# Altium schematic sheet xbowtie1.SchDoc
size A3; SheetNumber: 1; SheetTotal: 3
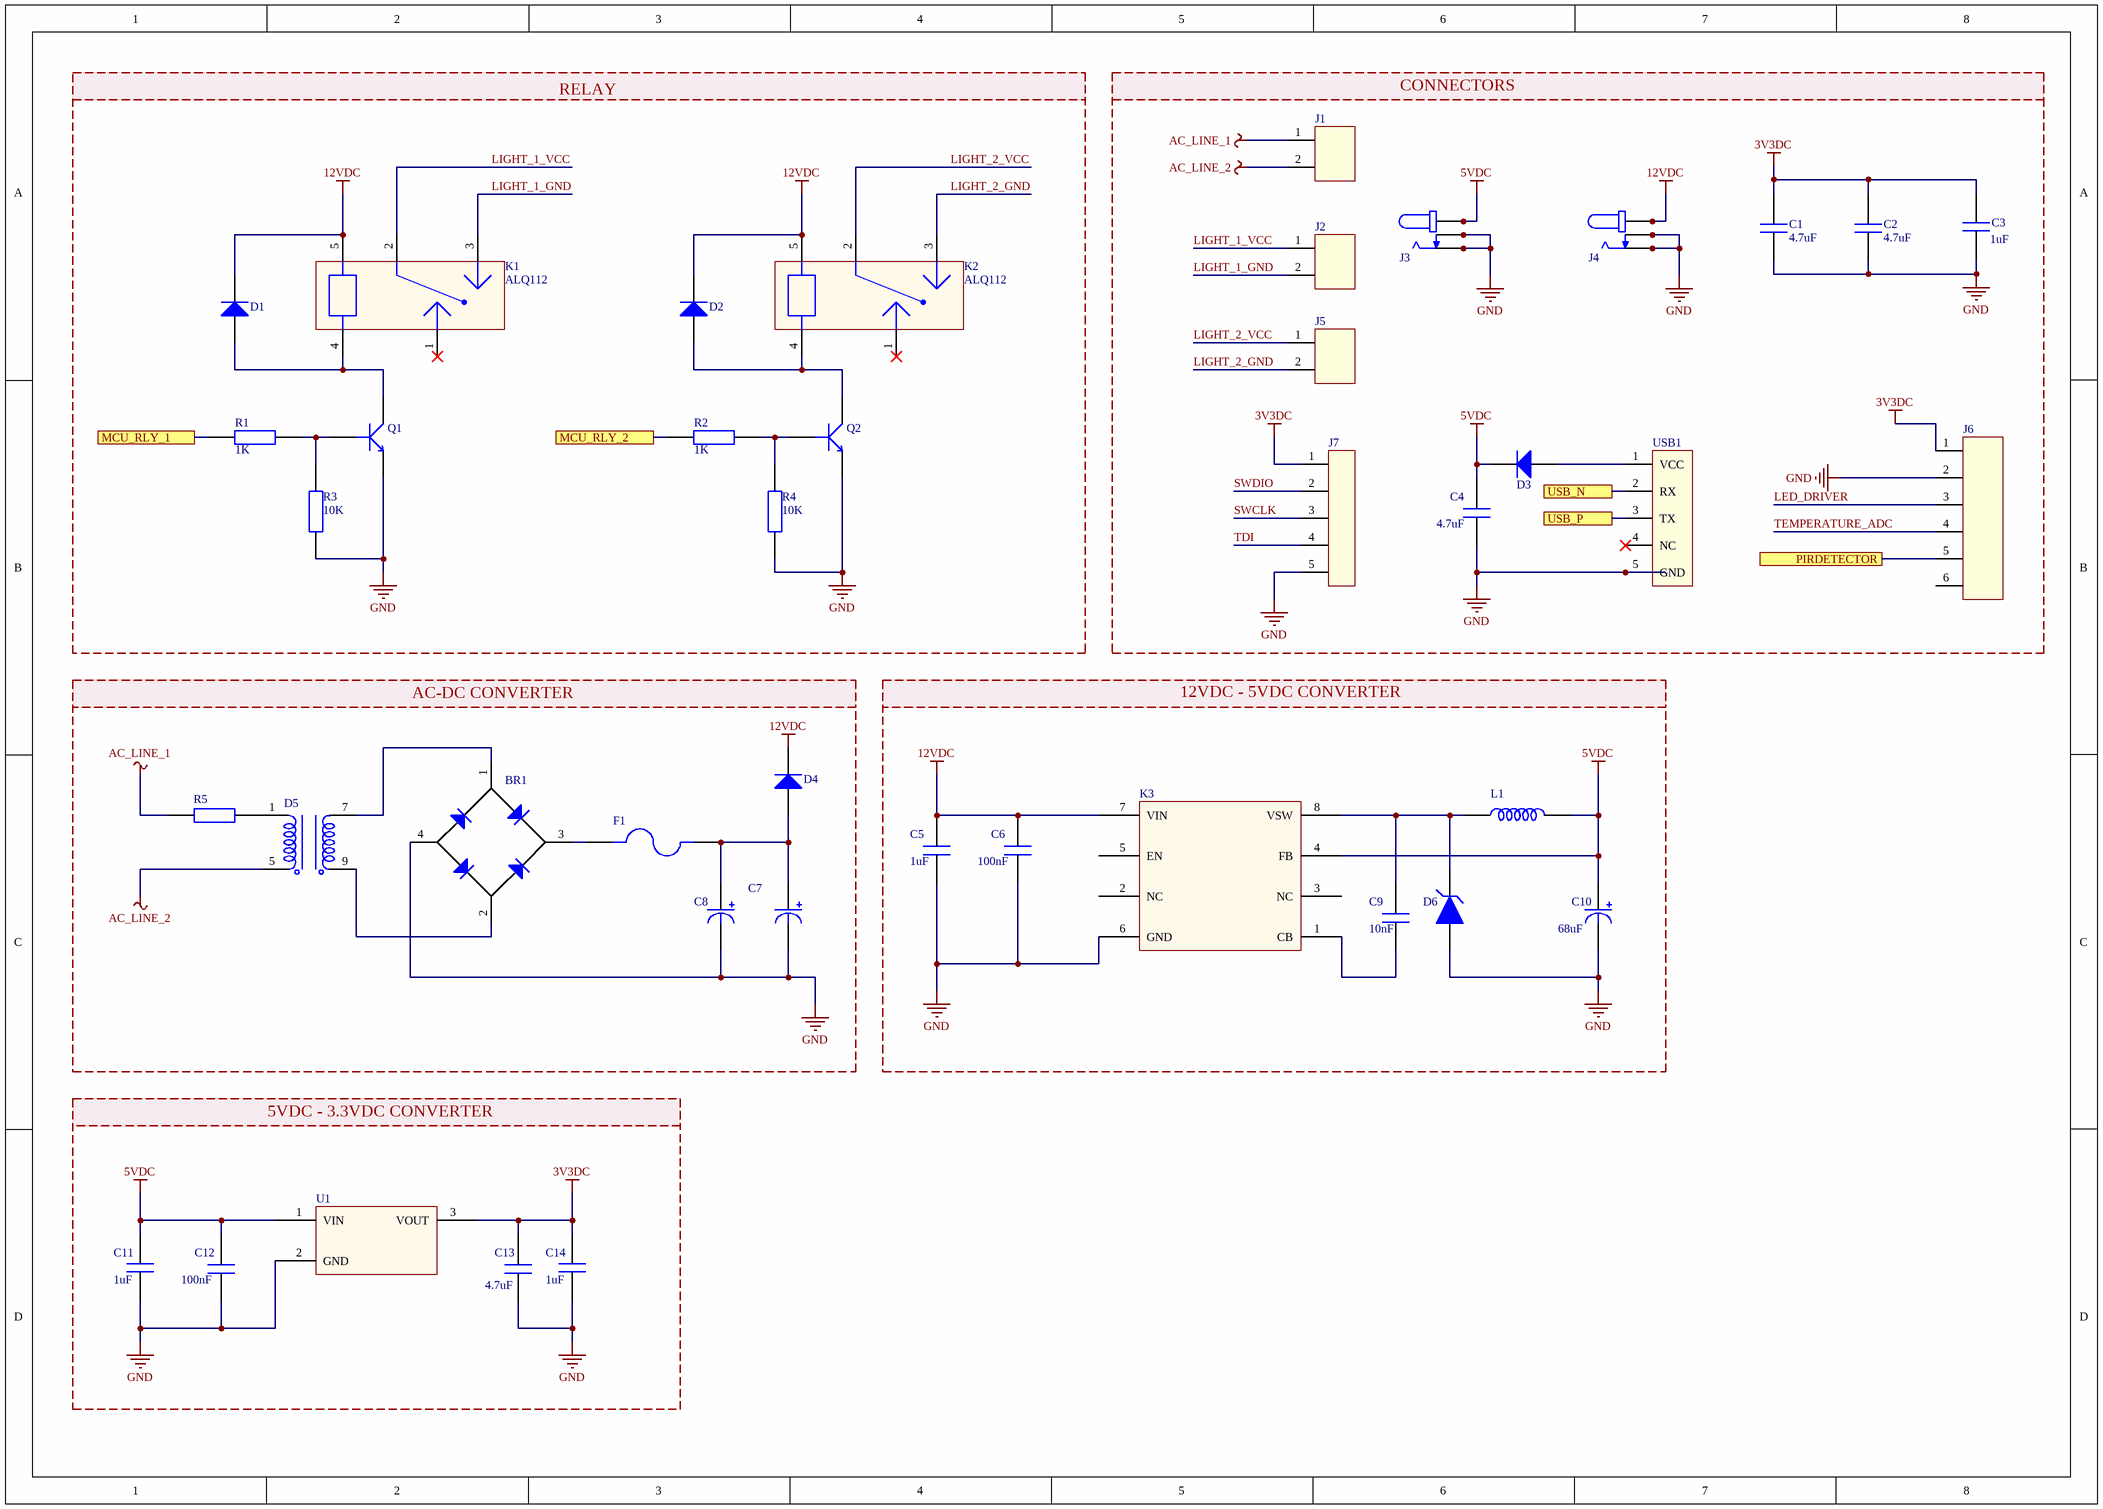
[diagram p0: xbowtie1.SchDoc]

## Parts
BR1  DB105STR  [DB105STR]  (value not drawn)
C1  4.7uF  [CAP_CER 0805]
C2  4.7uF  [CAP_CER 0805]
C3  Capacitance: 1uF  [CAP_CER 0805]  (hidden comment: CAP CER 1uF 0805)
C4  4.7uF  [CAP_CER 0805]
C5  1uF  [CAP_CER 0805]
C6  100nF  [CAP_CER 0805]
C7  ESH477M050AH4AA  [ESH477]  (value not drawn)
C8  ESH477M050AH4AA  [ESH477]  (value not drawn)
C9  10nF  [cap_0603]
C10  68uF  [CAP ALU 68 uF]
C11  Capacitance: 1uF  [CAP_CER 0805]  (hidden comment: CAP CER 1uF 0805)
C12  100nF  [CAP_CER 0805]
C13  Capacitance: 4.7uF  [CAP_CER 0805]  (hidden comment: CAP CER 4.7uF 0805)
C14  Capacitance: 1uF  [CAP_CER 0805]  (hidden comment: CAP CER 1uF 0805)
D1  1N4148WS  [1N4148WS]  (value not drawn)
D2  1N4148WS  [1N4148WS]  (value not drawn)
D3  1N4148WS  [1N4148WS]  (value not drawn)
D4  1N4148WS  [1N4148WS]  (value not drawn)
D5  BV302S12010_ZU  [BV302S]  (value not drawn)
D6  1SMB5919BT3G  [1SMB5919BT3G]  (value not drawn)
F1  FUSE 3413.0216.22  [FUSE 3413.0216.22]  (value not drawn)
J1  TBP01R1-508-02BE  [TBP01R1-508]  (value not drawn)
J2  TBP01R1-508-02BE  [TBP01R1-508]  (value not drawn)
J3  PJ-037AH-SMT-TR  [JACK]  (value not drawn)
J4  PJ-037AH-SMT-TR  [JACK]  (value not drawn)
J5  TBP01R1-508-02BE  [TBP01R1-508]  (value not drawn)
J6  64800611622  [64800611622]  (value not drawn)
J7  SMH-105-02-LS  [5 PIN CONNECTOR]  (value not drawn)
K1  ALQ112  [ALQ112]
K2  ALQ112  [ALQ112]
K3  LM2675MX-12/NOPB  [LM2675MX-12/NOPB]  (value not drawn)
L1  78438335470  [IND_1212]  (value not drawn)
Q1  MMBT3904-7-F  [MMBT3904-7-F]  (value not drawn)
Q2  MMBT3904-7-F  [MMBT3904-7-F]  (value not drawn)
R1  1K  [RES_0603]
R2  1K  [RES_0603]
R3  10K  [RES_0603]
R4  10K  [RES_0603]
R5  5WD27  [5WD27]  (value not drawn)
U1  AP7361-33E-13  [AP7361-33E-13]  (value not drawn)
USB1  10118192-0001LF  [MICRO_B_USB]  (value not drawn)

## Blocks framed on the sheet
RELAY: D1 D2 K1 K2 Q1 Q2 R1-R4

## Ports
MCU_RLY_1, MCU_RLY_2, PIRDETECTOR, USB_N, USB_P

## Nets
3V3DC: C1.2 C2.2 C3.2 C13.2 C14.2 J6.1(VCC) J7.1 U1.3(VOUT)
5VDC: C4.2 C10.1 C11.2 C12.2 D3.1 J3.1A J3.1B K3.4(FB) L1.2 U1.1(VIN)
12VDC: C5.2 C6.2 D1.1 D2.1 D4.1 J4.1A J4.1B K1.5 K2.5 K3.7(VIN)
AC_LINE_1: J1.1 R5.1
AC_LINE_2: D5.5 J1.2
GND: BR1.4 C1.1 C2.1 C3.1 C4.1 C5.1 C6.1 C7.2 C8.2 C10.2 C11.1 C12.1 C13.1 C14.1 D6.1 J3.2A J3.2B J3.3A J3.3B J4.2A J4.2B J4.3A J4.3B J6.2(RX) J7.5 K3.6(GND) Q1.2(E) Q2.2(E) R3.1 R4.1 U1.2(GND) USB1.5(GND)
LED_DRIVER: J6.3(TX)
LIGHT_1_GND: J2.2 K1.3
LIGHT_1_VCC: J2.1 K1.2
LIGHT_2_GND: J5.2 K2.3
LIGHT_2_VCC: J5.1 K2.2
MCU_RLY_1: R1.1 ; port MCU_RLY_1
MCU_RLY_2: R2.1 ; port MCU_RLY_2
PIRDETECTOR: J6.5(GND) ; port PIRDETECTOR
SWCLK: J7.3
SWDIO: J7.2
TDI: J7.4
TEMPERATURE_ADC: J6.4(NC)
USB_N: USB1.2(RX) ; port USB_N
USB_P: USB1.3(TX) ; port USB_P
NetBR1_1: BR1.1 D5.7
NetBR1_2: BR1.2 D5.9
NetBR1_3: BR1.3 F1.1
NetC7_1: C7.1 C8.1 D4.2 F1.2
NetC9_1: C9.1 K3.1(CB)
NetC9_2: C9.2 D6.2 K3.8(VSW) L1.1
NetD1_2: D1.2 K1.4 Q1.C
NetD2_2: D2.2 K2.4 Q2.C
NetD3_2: D3.2 USB1.1(VCC)
NetD5_1: D5.1 R5.2
NetQ1_1: Q1.1(B) R1.2 R3.2
NetQ2_1: Q2.1(B) R2.2 R4.2

Not connected (* = marked no-connect by the designer): J6 6(GND); K1 1(2)*; K2 1(2)*; K3 2(NC) 3(NC) 5(EN); USB1 4(NC)*

## Notes on the sheet
- CONNECTORS
- AC-DC CONVERTER
- 12VDC - 5VDC CONVERTER
- 5VDC - 3.3VDC CONVERTER

## Library data of the parts
C1 C2 C4 C13 = CAP CER 4.7uF 0805: Manufacturer: Samsung; Manufacturer Part Number: CL21A475KBQNNNE; Material: 4241ConductorMaterial; Tolerance: 10%; Voltage Rating: 50V; Dielectric: X5R; Supplier 1: Digikey; RoHS: Yes; Category: Ceramic Capacitors; Stock 1: 277343; Pricing 1: 1=0,23, 10=0,148, 50=0,104, 100=0,084, 500=0,06244, 1000=0,05464 (USD); Mount: Surface Mount; Case/Package: 0805; Case Code (Metric): 2012; Case Code (Imperial): 0805; Min Operating Temperature: -55°C; Max Operating Temperature: 85°C; Packaging: Tape and Reel; Series: CL; Voltage Rating (DC): 50V; Package Quantity: 1; Length: 2mm; Width: 0.049inch; Thickness: 0.055inch; Depth: 1.25mm; Radiation Hardening: No; RoHS Compliant: Yes; ComponentLink1URL: https://datasheet.ciiva.com/25797/cl21a475kbqnnne-25797730.pdf?src-supplier=Digikey; ComponentLink1Description: https://datasheet.ciiva.com/25797/cl21a475kbqnnne-25797730.pdf?src-supplier=Digikey; ComponentLink2URL: https://datasheet.ciiva.com/16428/cl21a475kbqnnne-16428877.pdf?src-supplier=Future+Electronics; ComponentLink2Description: https://datasheet.ciiva.com/16428/cl21a475kbqnnne-16428877.pdf?src-supplier=Future+Electronics; ComponentLink3URL: https://datasheet.ciiva.com/26838/getdatasheetpartid-470982-26838620.pdf?src-supplier=Verical; ComponentLink3Description: https://datasheet.ciiva.com/26838/getdatasheetpartid-470982-26838620.pdf?src-supplier=Verical; Supplier Part Number 1: 1276-1248-1-ND
  C1 C2 C4: Capacitance: 4.7uF
C3 C5 C11 C14 = CAP CER 1uF 0805: CAP CER 1uF %10 0805; Manufacturer: Samsung; Manufacturer Part Number: CL21B105KBFNNNE; Material: Ceramic; Tolerance: 10%; Voltage Rating: 50V; Dielectric: X7R; Supplier 1: Digikey; RoHS: Yes; Category: Ceramic Capacitors; Stock 1: 1550845; Pricing 1: 1=0,11, 10=0,075, 50=0,045, 100=0,0354, 500=0,02616, 1000=0,02165 (USD); Mount: Surface Mount; Case/Package: 0805; Case Code (Metric): 2012; Case Code (Imperial): 0805; Min Operating Temperature: -55°C; Max Operating Temperature: 125°C; Packaging: Tape and Reel; Package Quantity: 1; Voltage: 50V; Series: CL; Construction: Flat; Voltage Rating (DC): 50V; Length: 2mm; Width: 0.049inch; Height: 1.25mm; Thickness: 0.053inch; Depth: 1.25mm; Radiation Hardening: No; RoHS Compliant: Yes; ComponentLink1URL: https://datasheet.ciiva.com/25800/cl21b105kbfnnne-25800291.pdf?src-supplier=Digikey; ComponentLink1Description: https://datasheet.ciiva.com/25800/cl21b105kbfnnne-25800291.pdf?src-supplier=Digikey; Supplier Part Number 1: 1276-1029-1-ND
  C5: Capacitance: 1uF
C6 C12 = CAP CER 100nF 0805
C7 C8 = ESH477M050AH4AA: Cap, 470UF, 50V, Alu Elec, Radial; Manufacturer: KEMET; Supplier 1: Digikey; Manufacturer Part Number: ESH477M050AH4AA; RoHS: Yes; Stock 1: 10867; Pricing 1: 1=0,64, 10=0,432, 200=0,28415, 1000=0,1887, 5000=0,1665, 10000=0,1554 (USD); ComponentLink1URL: https://api.kemet.com/component-edge/download/datasheet/ESH477M050AH4AA.pdf?src-supplier=Digikey; ComponentLink1Description: https://api.kemet.com/component-edge/download/datasheet/ESH477M050AH4AA.pdf?src-supplier=Digikey; ComponentLink2URL: https://datasheet.octopart.com/ESH477M050AH4AA-KEMET-datasheet-130075338.pdf?src-supplier=Newark; ComponentLink2Description: https://datasheet.octopart.com/ESH477M050AH4AA-KEMET-datasheet-130075338.pdf?src-supplier=Newark; Supplier Part Number 1: 399-15683-ND
C9 = CAP CER 10nF 0603: Manufacturer: Walsin Technologies; Manufacturer Part Number: 0603B103K160CT; Supplier 1: Digikey; RoHS: Yes; Category: Ceramic Capacitors; Stock 1: 97748; Pricing 1: 1=0,1, 10=0,032, 50=0,0182, 100=0,0141, 500=0,0106, 1000=0,00833 (USD); Lead Free: 5697LeadFree; ComponentLink1URL: http://www.farnell.com/datasheets/1958513.pdf?src-supplier=Farnell; ComponentLink1Description: http://www.farnell.com/datasheets/1958513.pdf?src-supplier=Farnell; ComponentLink2URL: https://datasheet.octopart.com/0603B103K160CT-Walsin-Technologies-datasheet-136037192.pdf?src-supplier=Future+Electronics; ComponentLink2Description: https://datasheet.octopart.com/0603B103K160CT-Walsin-Technologies-datasheet-136037192.pdf?src-supplier=Future+Electronics; ComponentLink3URL: http://www.passivecomponent.com/wp-content/uploads/2018/10/MLCC.pdf?src-supplier=Digikey; ComponentLink3Description: http://www.passivecomponent.com/wp-content/uploads/2018/10/MLCC.pdf?src-supplier=Digikey; ComponentLink4URL: https://datasheet.octopart.com/0603B103K160CT-Walsin-Technologies-datasheet-85392065.pdf?src-supplier=Element14; ComponentLink4Description: https://datasheet.octopart.com/0603B103K160CT-Walsin-Technologies-datasheet-85392065.pdf?src-supplier=Element14; ComponentLink5URL: https://datasheet.octopart.com/0603B103K160CT-Walsin-Technologies-datasheet-62066062.pdf?src-supplier=TME; ComponentLink5Description: https://datasheet.octopart.com/0603B103K160CT-Walsin-Technologies-datasheet-62066062.pdf?src-supplier=TME; Supplier Part Number 1: 1292-1384-1-ND
C10 = CAP ALU 68 uF: Cap Aluminum Lytic 68uF 35V 20%( 6.3 X 7.7mm) SMD 0.34 Ohm 280mA 2000h 105C T/R; Manufacturer: KEMET; Manufacturer Part Number: EEV686M035A9HAA; Supplier 1: Digikey; RoHS: Yes; Category: Aluminum Electrolytic Capacitors; Stock 1: 22813; Pricing 1: 1=0,59, 10=0,394, 50=0,3134, 100=0,2588, 500=0,2022 (USD); ComponentLink1URL: https://datasheet.ciiva.com/5365/kem-a4002-eev-535332-5365784.pdf?src-supplier=Mouser; ComponentLink1Description: https://datasheet.ciiva.com/5365/kem-a4002-eev-535332-5365784.pdf?src-supplier=Mouser; Supplier Part Number 1: 399-6722-1-ND
D1-D4 = 1N4148WS: Diode Ultra Fast Recovery Rectifier 75V 0.15A 2-Pin SOD-323F T/R; Manufacturer: ON Semiconductor / Fairchild; Max Reverse Current: 5uA; Average Rectified Current: 150mA; Reverse Recovery Time: 4ns; Max Forward Surge Current (Ifsm): 2A; Capacitance: 4pF; Element Configuration: Single; Supplier 1: Digikey; Manufacturer Part Number: 1N4148WS; RoHS: Yes; Category: Rectifier Diodes; Stock 1: 807861; Pricing 1: 1=0,19, 10=0,136, 100=0,0733, 500=0,0576, 1000=0,04 (USD); Mount: Surface Mount; Number of Pins: 2; Weight: 0.0276g; Min Operating Temperature: -55°C; Max Operating Temperature: 150°C; Max Reverse Voltage (DC): 75V; Series: -; Packaging: Tape and Reel; Forward Current: 150mA; Package Quantity: 1; Recovery Time: 4ns; Max Repetitive Reverse Voltage (Vrrm): 75V; Reverse Voltage: 75V; Length: 1.8mm; Width: 1.35mm; Height: 1mm; Radiation Hardening: No; RoHS Compliant: Yes; Reach SVHC Compliant: No; Lead Free: Lead Free; ComponentLink1URL: https://datasheet.ciiva.com/15208/getdatasheetpartid-127819-15208358.pdf?src-supplier=Verical; ComponentLink1Description: https://datasheet.ciiva.com/15208/getdatasheetpartid-127819-15208358.pdf?src-supplier=Verical; ComponentLink2URL: https://datasheet.ciiva.com/8300/1n914bws-8300360.pdf?src-supplier=Avnet; ComponentLink2Description: https://datasheet.ciiva.com/8300/1n914bws-8300360.pdf?src-supplier=Avnet; ComponentLink3URL: https://datasheet.ciiva.com/910/1n4148ws-910381.pdf?src-supplier=Digikey; ComponentLink3Description: https://datasheet.ciiva.com/910/1n4148ws-910381.pdf?src-supplier=Digikey; Supplier Part Number 1: 1N4148WSFSCT-ND
D6 = 1SMB5919BT3G: Vz=5.6V 5.32V~5.88V Izt=66.9mA; Manufacturer: ON Semiconductor; Supplier 1: Digikey; Manufacturer Part Number: 1SMB5919BT3G; RoHS: Yes; Category: Zener Diodes; Stock 1: 209; Pricing 1: 1=0,48, 10=0,341, 100=0,1722, 500=0,15262, 1000=0,11878 (USD); ComponentLink1URL: https://datasheet.ciiva.com/27747/1308331-27747654.pdf?src-supplier=Jameco; ComponentLink1Description: https://datasheet.ciiva.com/27747/1308331-27747654.pdf?src-supplier=Jameco; ComponentLink2URL: https://datasheet.ciiva.com/1182/1smb5913bt3-d-1182657.pdf?src-supplier=Element14; ComponentLink2Description: https://datasheet.ciiva.com/1182/1smb5913bt3-d-1182657.pdf?src-supplier=Element14; ComponentLink3URL: https://datasheet.ciiva.com/1182/1smb5913bt3-d-1182658.pdf?src-supplier=Element14; ComponentLink3Description: https://datasheet.ciiva.com/1182/1smb5913bt3-d-1182658.pdf?src-supplier=Element14; ComponentLink4URL: https://datasheet.ciiva.com/895/1smb5913bt3-d-895203.pdf?src-supplier=Digikey; ComponentLink4Description: https://datasheet.ciiva.com/895/1smb5913bt3-d-895203.pdf?src-supplier=Digikey; ComponentLink5URL: https://datasheet.ciiva.com/895/1smb5913bt3-d-895204.pdf?src-supplier=Digikey; ComponentLink5Description: https://datasheet.ciiva.com/895/1smb5913bt3-d-895204.pdf?src-supplier=Digikey; ComponentLink6URL: https://datasheet.ciiva.com/895/1smb5913bt3-d-895205.pdf?src-supplier=Digikey; ComponentLink6Description: https://datasheet.ciiva.com/895/1smb5913bt3-d-895205.pdf?src-supplier=Digikey; ComponentLink7URL: https://datasheet.ciiva.com/15198/getdatasheetpartid-311040-15198695.pdf?src-supplier=Verical; ComponentLink7Description: https://datasheet.ciiva.com/15198/getdatasheetpartid-311040-15198695.pdf?src-supplier=Verical; ComponentLink8URL: https://datasheet.ciiva.com/16311/1smb5913bt3-d-16311847.pdf?src-supplier=Future+Electronics; ComponentLink8Description: https://datasheet.ciiva.com/16311/1smb5913bt3-d-16311847.pdf?src-supplier=Future+Electronics; Supplier Part Number 1: 1SMB5919BT3GOSCT-ND
F1 = FUSE 3413.0216.22: Fuse Chip Fast Acting 1A 32V SMD Solder Pad 1206 Glass T/R VDE/cULus; Manufacturer: Schurter; Body Material: Glass,Epoxy; Voltage Rating (DC): 63V; DC Cold Resistance: 94.2mR; Fuse Type: Board Mount (Cartridge Style Excluded); Approvals: VDE,cURus; Designed by: Nisanur; Supplier 1: Digikey; Manufacturer Part Number: 3413.0216.22; RoHS: Yes; Category: Fuses; Stock 1: 15097; Pricing 1: 1=0,67, 50=0,524, 100=0,397, 500=0,345 (USD); Mount: Surface Mount,PCB; Case/Package: 1206; Number of Pins: 2; Weight: 0.000212oz; Case Code (Metric): 3216; Case Code (Imperial): 1206; Contact Plating: Gold; Terminal Material: Tin; Min Operating Temperature: -55°C; Max Operating Temperature: 90°C; Current Rating: 1A; Package Quantity: 1000; Voltage Rating (AC): 32V; Packaging: Tape and Reel; Voltage Rating: 32V; Termination: SMD/SMT; Working Voltage: 32V; Series: USI 1206; Length: 3.2mm; Width: 1.6mm; Height: 0.6mm; Lead Free: Lead Free; RoHS Compliant: Yes; ComponentLink1URL: https://datasheet.ciiva.com/301/typ-usi-1206-301440.pdf?src-supplier=Digikey; ComponentLink1Description: https://datasheet.ciiva.com/301/typ-usi-1206-301440.pdf?src-supplier=Digikey; ComponentLink2URL: https://datasheet.ciiva.com/8264/typ-usi-1206-8264583.pdf?src-supplier=Avnet; ComponentLink2Description: https://datasheet.ciiva.com/8264/typ-usi-1206-8264583.pdf?src-supplier=Avnet; ComponentLink3URL: https://datasheet.ciiva.com/16316/typ-usi-1206-16316588.pdf?src-supplier=Future+Electronics; ComponentLink3Description: https://datasheet.ciiva.com/16316/typ-usi-1206-16316588.pdf?src-supplier=Future+Electronics; ComponentLink4URL: https://datasheet.ciiva.com/301/typ-usi-1206-301439.pdf?src-supplier=Digikey; ComponentLink4Description: https://datasheet.ciiva.com/301/typ-usi-1206-301439.pdf?src-supplier=Digikey; ComponentLink5URL: https://datasheet.ciiva.com/14541/70160006-14541114.pdf?src-supplier=Allied+Electronics; ComponentLink5Description: https://datasheet.ciiva.com/14541/70160006-14541114.pdf?src-supplier=Allied+Electronics; ComponentLink6URL: https://datasheet.ciiva.com/14102/qousi1206-data-e-14102903.pdf?src-supplier=Distrelec; ComponentLink6Description: https://datasheet.ciiva.com/14102/qousi1206-data-e-14102903.pdf?src-supplier=Distrelec; ComponentLink7URL: https://datasheet.ciiva.com/301/typ-usi-1206-301441.pdf?src-supplier=Digikey; ComponentLink7Description: https://datasheet.ciiva.com/301/typ-usi-1206-301441.pdf?src-supplier=Digikey; Supplier Part Number 1: 486-1144-1-ND
J1 J2 J5 = TBP01R1-508-02BE: 2~24 Poles, Pluggable, Receptacle, Horizontal, 5.08 Pitch, Terminal Block Connector; Manufacturer: CUI Devices; Supplier 1: Digikey; Manufacturer Part Number: TBP01R1-508-02BE; RoHS: Yes; Category: Terminal Blocks; Stock 1: 103835; Pricing 1: 1=0,48, 10=0,252, 25=0,1788, 50=0,152, 100=0,1466, 250=0,12396, 500=0,11464, 1000=0,10131, 5000=0,07731 (USD); ComponentLink1URL: https://www.cuidevices.com/product/resource/digikeypdf/tbp01r1-508.pdf?src-supplier=Digikey; ComponentLink1Description: https://www.cuidevices.com/product/resource/digikeypdf/tbp01r1-508.pdf?src-supplier=Digikey; ComponentLink2URL: https://datasheet.octopart.com/TBP01R1-508-02BE-CUI-Devices-datasheet-147843976.pdf?src-supplier=Future+Electronics; ComponentLink2Description: https://datasheet.octopart.com/TBP01R1-508-02BE-CUI-Devices-datasheet-147843976.pdf?src-supplier=Future+Electronics; ComponentLink3URL: https://datasheet.octopart.com/TBP01R1-508-02BE-CUI-Devices-datasheet-154730754.pdf?src-supplier=Electro+Sonic; ComponentLink3Description: https://datasheet.octopart.com/TBP01R1-508-02BE-CUI-Devices-datasheet-154730754.pdf?src-supplier=Electro+Sonic; Supplier Part Number 1: 102-6406-ND
J3 J4 = PJ-037AH-SMT-TR: 2.0 x 6.3 mm, 5.0 A, Horizontal, Surface Mount (SMT), Dc Power Jack Connector; Manufacturer: CUI; Number of Conductors: 2; Gender: Male; Shielding: Unshielded; Current Rating: 5A; Voltage Rating: 24V; Insulation Resistance: 100MR; Supplier 1: Digikey; Manufacturer Part Number: PJ-037AH-SMT-TR; RoHS: Yes; Category: Uncategorized; Mount: Surface Mount,Through Hole; Case/Package: SMD/SMT; Color: Black; Contact Material: Copper; Contact Plating: Nickel; Housing Color: Black; Housing Material: Thermoplastic; Min Operating Temperature: -25°C; Max Operating Temperature: 85°C; Orientation: Horizontal; Package Quantity: 200; Termination: Solder; Connector Type: Jack; Contact Gender: Male; Packaging: Tape and Reel; Flammability Rating: UL94 V-0; ComponentLink1URL: http://www.mouser.com/ds/2/670/pj-037ah-smt-516065.pdf?src-supplier=Mouser; ComponentLink1Description: http://www.mouser.com/ds/2/670/pj-037ah-smt-516065.pdf?src-supplier=Mouser; ComponentLink2URL: https://www.cui.com/product/resource/digikeypdf/pj-037ah-smt-tr.pdf?src-supplier=Digikey; ComponentLink2Description: https://www.cui.com/product/resource/digikeypdf/pj-037ah-smt-tr.pdf?src-supplier=Digikey; ComponentLink3URL: http://www.cui.com/product/resource/digikeypdf/pj-037ah-smt.pdf?src-supplier=Digikey; ComponentLink3Description: http://www.cui.com/product/resource/digikeypdf/pj-037ah-smt.pdf?src-supplier=Digikey; Supplier Part Number 1: CP-037AHPJTR-ND
J6 = 64800611622_conn_6pin: 1.50 mm, 6 pin connector; Manufacturer: Wurth Electronics; Supplier 1: Digikey; Manufacturer Part Number: 64800611622; RoHS: No; Category: Uncategorized; Stock 1: 589; Pricing 1: 1=0,42, 50=0,406, 100=0,384, 250=0,361, 500=0,339 (USD); Supplier Part Number 1: 732-64800611622-ND
J7 = SMH-105-02-LS: Samtec - SMH-105-02-L-S - Receptacle, 2.54MM, Tht, R/a, 5WAY; Number of Contacts: 5; Supplier 1: Digikey; Manufacturer: Samtec; Manufacturer Part Number: SMH-105-02-L-S; RoHS: Yes; Category: Connectors; Stock 1: 38; Pricing 1: 1=2,18, 10=1,899, 100=1,6968, 500=1,414, 1000=1,212, 5000=1,07464 (USD); Contact Plating: Gold; Contact Material: Bronze; Contact Finish - Mating: GOLD; Insulation Color: Black; Insulation Material: Polymer; Contact Shape: Square; Min Operating Temperature: -55°C; Max Operating Temperature: 125°C; Packaging: Rail/Tube; Number of Rows: 1; Termination: Solder; Gender: Receptacle; Orientation: Horizontal; Connector Type: Receptacle; Fastening Type: Pull; Series: SMH; Contact Type: Forked; Number of Positions: 5; Pitch: 2.54mm; Radiation Hardening: No; RoHS Compliant: Yes; Reach SVHC Compliant: No; Flammability Rating: UL94 V-0; ComponentLink1URL: http://www.farnell.com/datasheets/1927708.pdf?_ga=2.237598468.569325269.1503285096-1413671594.1503025027&src-supplier=Farnell; ComponentLink1Description: http://www.farnell.com/datasheets/1927708.pdf?_ga=2.237598468.569325269.1503285096-1413671594.1503025027&src-supplier=Farnell; ComponentLink2URL: http://www.samtec.com/documents/webfiles/pdf/SMH.PDF?src-supplier=Newark; ComponentLink2Description: http://www.samtec.com/documents/webfiles/pdf/SMH.PDF?src-supplier=Newark; ComponentLink3URL: http://www.samtec.com/documents/webfiles/pdf/SMH.PDF?src-supplier=Avnet; ComponentLink3Description: http://www.samtec.com/documents/webfiles/pdf/SMH.PDF?src-supplier=Avnet; ComponentLink4URL: http://suddendocs.samtec.com/catalog_english/smh.pdf?src-supplier=Digikey; ComponentLink4Description: http://suddendocs.samtec.com/catalog_english/smh.pdf?src-supplier=Digikey; Supplier Part Number 1: SAM11813-ND
K1 K2 = ALQ112: Electromechanical Relay 12VDC 360Ohm 10(NO)/3(NC)A SPDT (( 20mm 10mm 16mm)) THT Power Relay; Manufacturer: Panasonic; Supplier 1: Digikey; Manufacturer Part Number: ALQ112; RoHS: Yes; Category: Power Relays; Stock 1: 36095; Pricing 1: 1=1,28, 10=1,204, 25=1,0704, 50=1,017, 100=0,9635, 250=0,85648, 500=0,80296, 1000=0,74942, 5000=0,72266 (USD); ComponentLink1URL: https://datasheet.ciiva.com/24388/307ds-61b20-en-lq-24388909.pdf?src-supplier=Onlinecomponents.com; ComponentLink1Description: https://datasheet.ciiva.com/24388/307ds-61b20-en-lq-24388909.pdf?src-supplier=Onlinecomponents.com; Supplier Part Number 1: 255-3562-ND
K3 = LM2675MX-12/NOPB: SIMPLE SWITCHER® 6.5V to 40V, 1A Low Component Count Step-Down Regulator 8-SOIC -40 to 125; Manufacturer: TI National Semiconductor; Number of Outputs: 1; Output Voltage: 12V; Efficiency: 94%; Min Input Voltage: 8V; Switching Frequency: 260kHz; Quiescent Current: 2.5mA; Output Type: Fixed; Supplier 1: Digikey; Manufacturer Part Number: LM2675MX-12/NOPB; RoHS: Yes; Category: Voltage Regulators - Switching; Stock 1: 811; Pricing 1: 1=4,71, 10=4,231, 25=3,9996, 100=3,4663, 250=3,28856, 500=2,95082, 1000=2,48864 (USD); Mount: Surface Mount; Case/Package: SOIC N; Number of Pins: 8; Min Operating Temperature: -40°C; Max Operating Temperature: 125°C; Output Current: 1A; Packaging: Tape and Reel; Max Output Current: 1A; Max Input Voltage: 40V; Package Quantity: 2500; Operating Supply Voltage: 40V; Series: LM2675; Radiation Hardening: No; Lead Free: Lead Free; RoHS Compliant: Yes; ComponentLink1URL: https://datasheet.ciiva.com/41457/001013881-da-01-en-ic-reg-buck-lm2675mx-12-nopb-soic-8-tid-41457896.pdf?src-supplier=Conrad; ComponentLink1Description: https://datasheet.ciiva.com/41457/001013881-da-01-en-ic-reg-buck-lm2675mx-12-nopb-soic-8-tid-41457896.pdf?src-supplier=Conrad; ComponentLink2URL: https://datasheet.ciiva.com/3220/lm2675-3220840.pdf?src-supplier=Avnet; ComponentLink2Description: https://datasheet.ciiva.com/3220/lm2675-3220840.pdf?src-supplier=Avnet; Supplier Part Number 1: 296-35410-1-ND
L1 = IND 47 uH: Power Inductor, Aec-Q200, 47Uh, 0.39A Rohs Compliant: Yes |Wurth Elektronik 78438335470; Manufacturer: Wurth Electronics; Core Material: Ferrite; Current Rating: 390mA; Saturation Current: 1.18A; Shielding: Shielded; DC Resistance (DCR): 2.3R; Self Resonant Frequency: 8MHz; Test Frequency: 100kHz; Tolerance: 30%; Supplier 1: Digikey; Manufacturer Part Number: 78438335470; RoHS: Yes; Category: Fixed Inductors; Stock 1: 14725; Pricing 1: 1=2,11, 50=1,97, 250=1,803, 500=1,672 (USD); Mount: Surface Mount; Case/Package: 1212; Case Code (Metric): 3030; Case Code (Imperial): 1212; Min Operating Temperature: -40°C; Max Operating Temperature: 125°C; Packaging: Cut Tape; Inductance: 47uH; Series: WE-MAIA; Length: 0.118inch; Width: 0.118inch; Height - Seated (Max): 0.059inch; Ratings: AEC-Q200; RoHS Compliant: Yes; ComponentLink1URL: https://media.digikey.com/pdf/Data%20Sheets/Wurth%20Electronics%20PDFs/Q+_Products_Flyer.pdf?src-supplier=Digikey; ComponentLink1Description: https://media.digikey.com/pdf/Data%20Sheets/Wurth%20Electronics%20PDFs/Q+_Products_Flyer.pdf?src-supplier=Digikey; Supplier Part Number 1: 732-6947-6-ND
Q1 Q2 = MMBT3904-7-F: Transistor General Purpose BJT NPN 40 Volt 0.2A Automotive 3-Pin SOT-23; Manufacturer: Diodes Zetex; Max Power Dissipation: 300mW; Collector Emitter Voltage (VCEO): 40V; Max Collector Current: 200mA; Collector Base Voltage (VCBO): 60V; Power Dissipation: 350mW; Frequency: 300MHz; hFE Min: 100; Number of Elements: 1; Emitter Base Voltage (VEBO): 6V; Collector Emitter Saturation Voltage: 300mV; Supplier 1: Digikey; Manufacturer Part Number: MMBT3904-7-F; RoHS: Yes; Category: BJTs; Stock 1: 5031738; Pricing 1: 1=0,12, 10=0,086, 100=0,0467, 500=0,03666, 1000=0,02545 (USD); Mount: Surface Mount; Case/Package: SOT-23; Number of Pins: 3; Weight: 0.000282oz; Min Operating Temperature: -55°C; Max Operating Temperature: 150°C; Polarity: NPN; Packaging: Tape and Reel; Voltage Rating (DC): 40V; Package Quantity: 3000; Transition Frequency: 300MHz; Collector Emitter Breakdown Voltage: 40V; Max Breakdown Voltage: 40V; Continuous Collector Current: 200mA; Max Frequency: 300MHz; Gain Bandwidth Product: 300MHz; Series: Automotive, AEC-Q101; Collector-emitter Voltage-Max: 300mV; Length: 3.05mm; Width: 1.4mm; Height: 1mm; Radiation Hardening: No; Reach SVHC Compliant: No; Lead Free: Lead Free; RoHS Compliant: Yes; ComponentLink1URL: https://datasheet.ciiva.com/11201/ds30036-11201778.pdf?src-supplier=Avnet; ComponentLink1Description: https://datasheet.ciiva.com/11201/ds30036-11201778.pdf?src-supplier=Avnet; ComponentLink2URL: https://datasheet.ciiva.com/15138/getdatasheetpartid-53265-15138780.pdf?src-supplier=Verical; ComponentLink2Description: https://datasheet.ciiva.com/15138/getdatasheetpartid-53265-15138780.pdf?src-supplier=Verical; ComponentLink3URL: https://datasheet.ciiva.com/22711/1915516-22711750.pdf?src-supplier=Element14; ComponentLink3Description: https://datasheet.ciiva.com/22711/1915516-22711750.pdf?src-supplier=Element14; ComponentLink4URL: https://datasheet.ciiva.com/11198/ds30036-11198999.pdf?src-supplier=Avnet; ComponentLink4Description: https://datasheet.ciiva.com/11198/ds30036-11198999.pdf?src-supplier=Avnet; ComponentLink5URL: https://datasheet.ciiva.com/6361/ds30036-6361256.pdf?src-supplier=Digikey; ComponentLink5Description: https://datasheet.ciiva.com/6361/ds30036-6361256.pdf?src-supplier=Digikey; ComponentLink6URL: https://datasheet.ciiva.com/6361/ds30036-6361254.pdf?src-supplier=Digikey; ComponentLink6Description: https://datasheet.ciiva.com/6361/ds30036-6361254.pdf?src-supplier=Digikey; Supplier Part Number 1: MMBT3904-FDICT-ND
R1 R2 = RES 1K OHM 0603
R3 R4 = RES 10K OHM 0603: Res Thin Film 0603 10K Ohm 0.1% 1/10W ±25ppm/°C Molded SMD SMD Punched Carrier T/R; Manufacturer: Panasonic; Manufacturer Part Number: ERA-3AEB103V; Resistance: 10kR; Power Rating: 100mW; Voltage Rating: 75V; Supplier 1: Digikey; RoHS: Yes; Category: Chip SMD Resistors; Stock 1: 16550; Pricing 1: 1=0,13, 10=0,098, 50=0,0778, 100=0,0697, 500=0,05308, 1000=0,04691 (USD); Mount: Surface Mount; Case/Package: 0603; Number of Pins: 2; Case Code (Metric): 1608; Case Code (Imperial): 0603; Size Code: 0603; Contact Plating: Tin; Min Operating Temperature: -55°C; Max Operating Temperature: 155°C; Temperature Coefficient: 25ppm/°C; Series: ERA-3A; Packaging: Tape and Reel; Tolerance: 0.1%; Number of Terminations: 2; Termination: SMD/SMT; Max Power Dissipation: 100mW; Resistor Type: Thin Film,Metal Film; Features: Automotive AEC-Q200; Voltage Rating (DC): 75V; Resistance Tolerance: 0.1%; Construction: Rectangular; Technology: METAL FILM; Package Quantity: 5000; Length: 1.6mm; Width: 0.8mm; Height: 0.45mm; Depth: 0.8mm; Ratings: AEC-Q200; Radiation Hardening: No; RoHS Compliant: Yes; Lead Free: 5697LeadFree; Reach SVHC Compliant: No; Military Standard: Not; Supplier Part Number 1: P10KDBCT-ND
U1 = AP7361-33E-13: AP7361 Series 3.3 V 1 A Low SMT Dropout Fixed-Mode Regulator - SOT-223; Manufacturer: Diodes; Number of Outputs: 1; Min Input Voltage: 2.2V; Max Input Voltage: 6V; Max Output Current: 1A; Output Voltage: 3.3V; Max Power Dissipation: 1.1W; Dropout Voltage: 500mV; Min Current Limit: 1.1A; Polarity: Positive; Quiescent Current: 70uA; Power Dissipation: 1.1kW; Accuracy: 1%; Power Supply Rejection Ratio (PSRR): 65dB; Reference Voltage: 800mV; Output Type: Fixed; Supplier 1: Digikey; Manufacturer Part Number: AP7361-33E-13; RoHS: Yes; Category: Voltage Regulators - Linear; Stock 1: 124979; Pricing 1: 1=0,51, 10=0,414, 25=0,3788, 100=0,2818, 250=0,2554, 500=0,21138, 1000=0,15853 (USD); Mount: Surface Mount; Case/Package: SOT-223; Number of Pins: 4; Weight: 0.000282oz; Contact Plating: Tin,Matte; Min Operating Temperature: -40°C; Max Operating Temperature: 85°C; Package Quantity: 1; Packaging: Tape and Reel; Output Current: 1A; Number of Regulators: 1; Series: -; Radiation Hardening: No; Reach SVHC Compliant: Yes; Lead Free: Lead Free; RoHS Compliant: Yes; ComponentLink1URL: https://datasheet.ciiva.com/26926/getdatasheetpartid-670786-26926141.pdf?src-supplier=Verical; ComponentLink1Description: https://datasheet.ciiva.com/26926/getdatasheetpartid-670786-26926141.pdf?src-supplier=Verical; ComponentLink2URL: https://datasheet.ciiva.com/29568/ap7361-29568378.pdf?src-supplier=Digikey; ComponentLink2Description: https://datasheet.ciiva.com/29568/ap7361-29568378.pdf?src-supplier=Digikey; Supplier Part Number 1: AP7361-33E-13DICT-ND
USB1 = MİCRO B USB Connector: CONN USB MICRO B RECPT SMT R/A; Manufacturer: Amphenol ICC / FCI; Gender: Receptacle; Connector Type: USB,Receptacle; USB Standard: USB 2.0; Number of Contacts: 5; Current Rating: 1.8A; Insulation Resistance: 1GR; Number of Ports: 1; Max Voltage Rating (AC): 100V; Pitch: 0.65mm; Supplier 1: Digikey; Manufacturer Part Number: 10118192-0001LF; RoHS: No; Category: Uncategorized; Stock 1: 75394; Pricing 1: 1=0,46, 10=0,404, 25=0,3696, 50=0,3478, 100=0,3334, 250=0,30436, 500=0,28988 (USD); Mount: Surface Mount,Horizontal; Number of Pins: 5; Color: Black; Contact Material: Copper Alloy; Contact Plating: Gold; Housing Material: Polymer; Min Operating Temperature: -55°C; Max Operating Temperature: 85°C; Orientation: Right Angle; Features: Shielded; Termination: Solder; Voltage Rating: 100V; Series: -; Packaging: Tape and Reel; Package Quantity: 1400; Length: 7.86mm; Depth: 5.57mm; Radiation Hardening: No; Flammability Rating: UL94 V-0; Reach SVHC Compliant: No; Supplier Part Number 1: 609-4613-1-ND